# EasyEDA schematic SCH_keyboard_2024-02-28.json
TITLE: Sheet_1; REV: 1.0; Date: 2024-02-24; Sheet: 1/1; Drawn By: arnav.purbiya; Company: Your Company
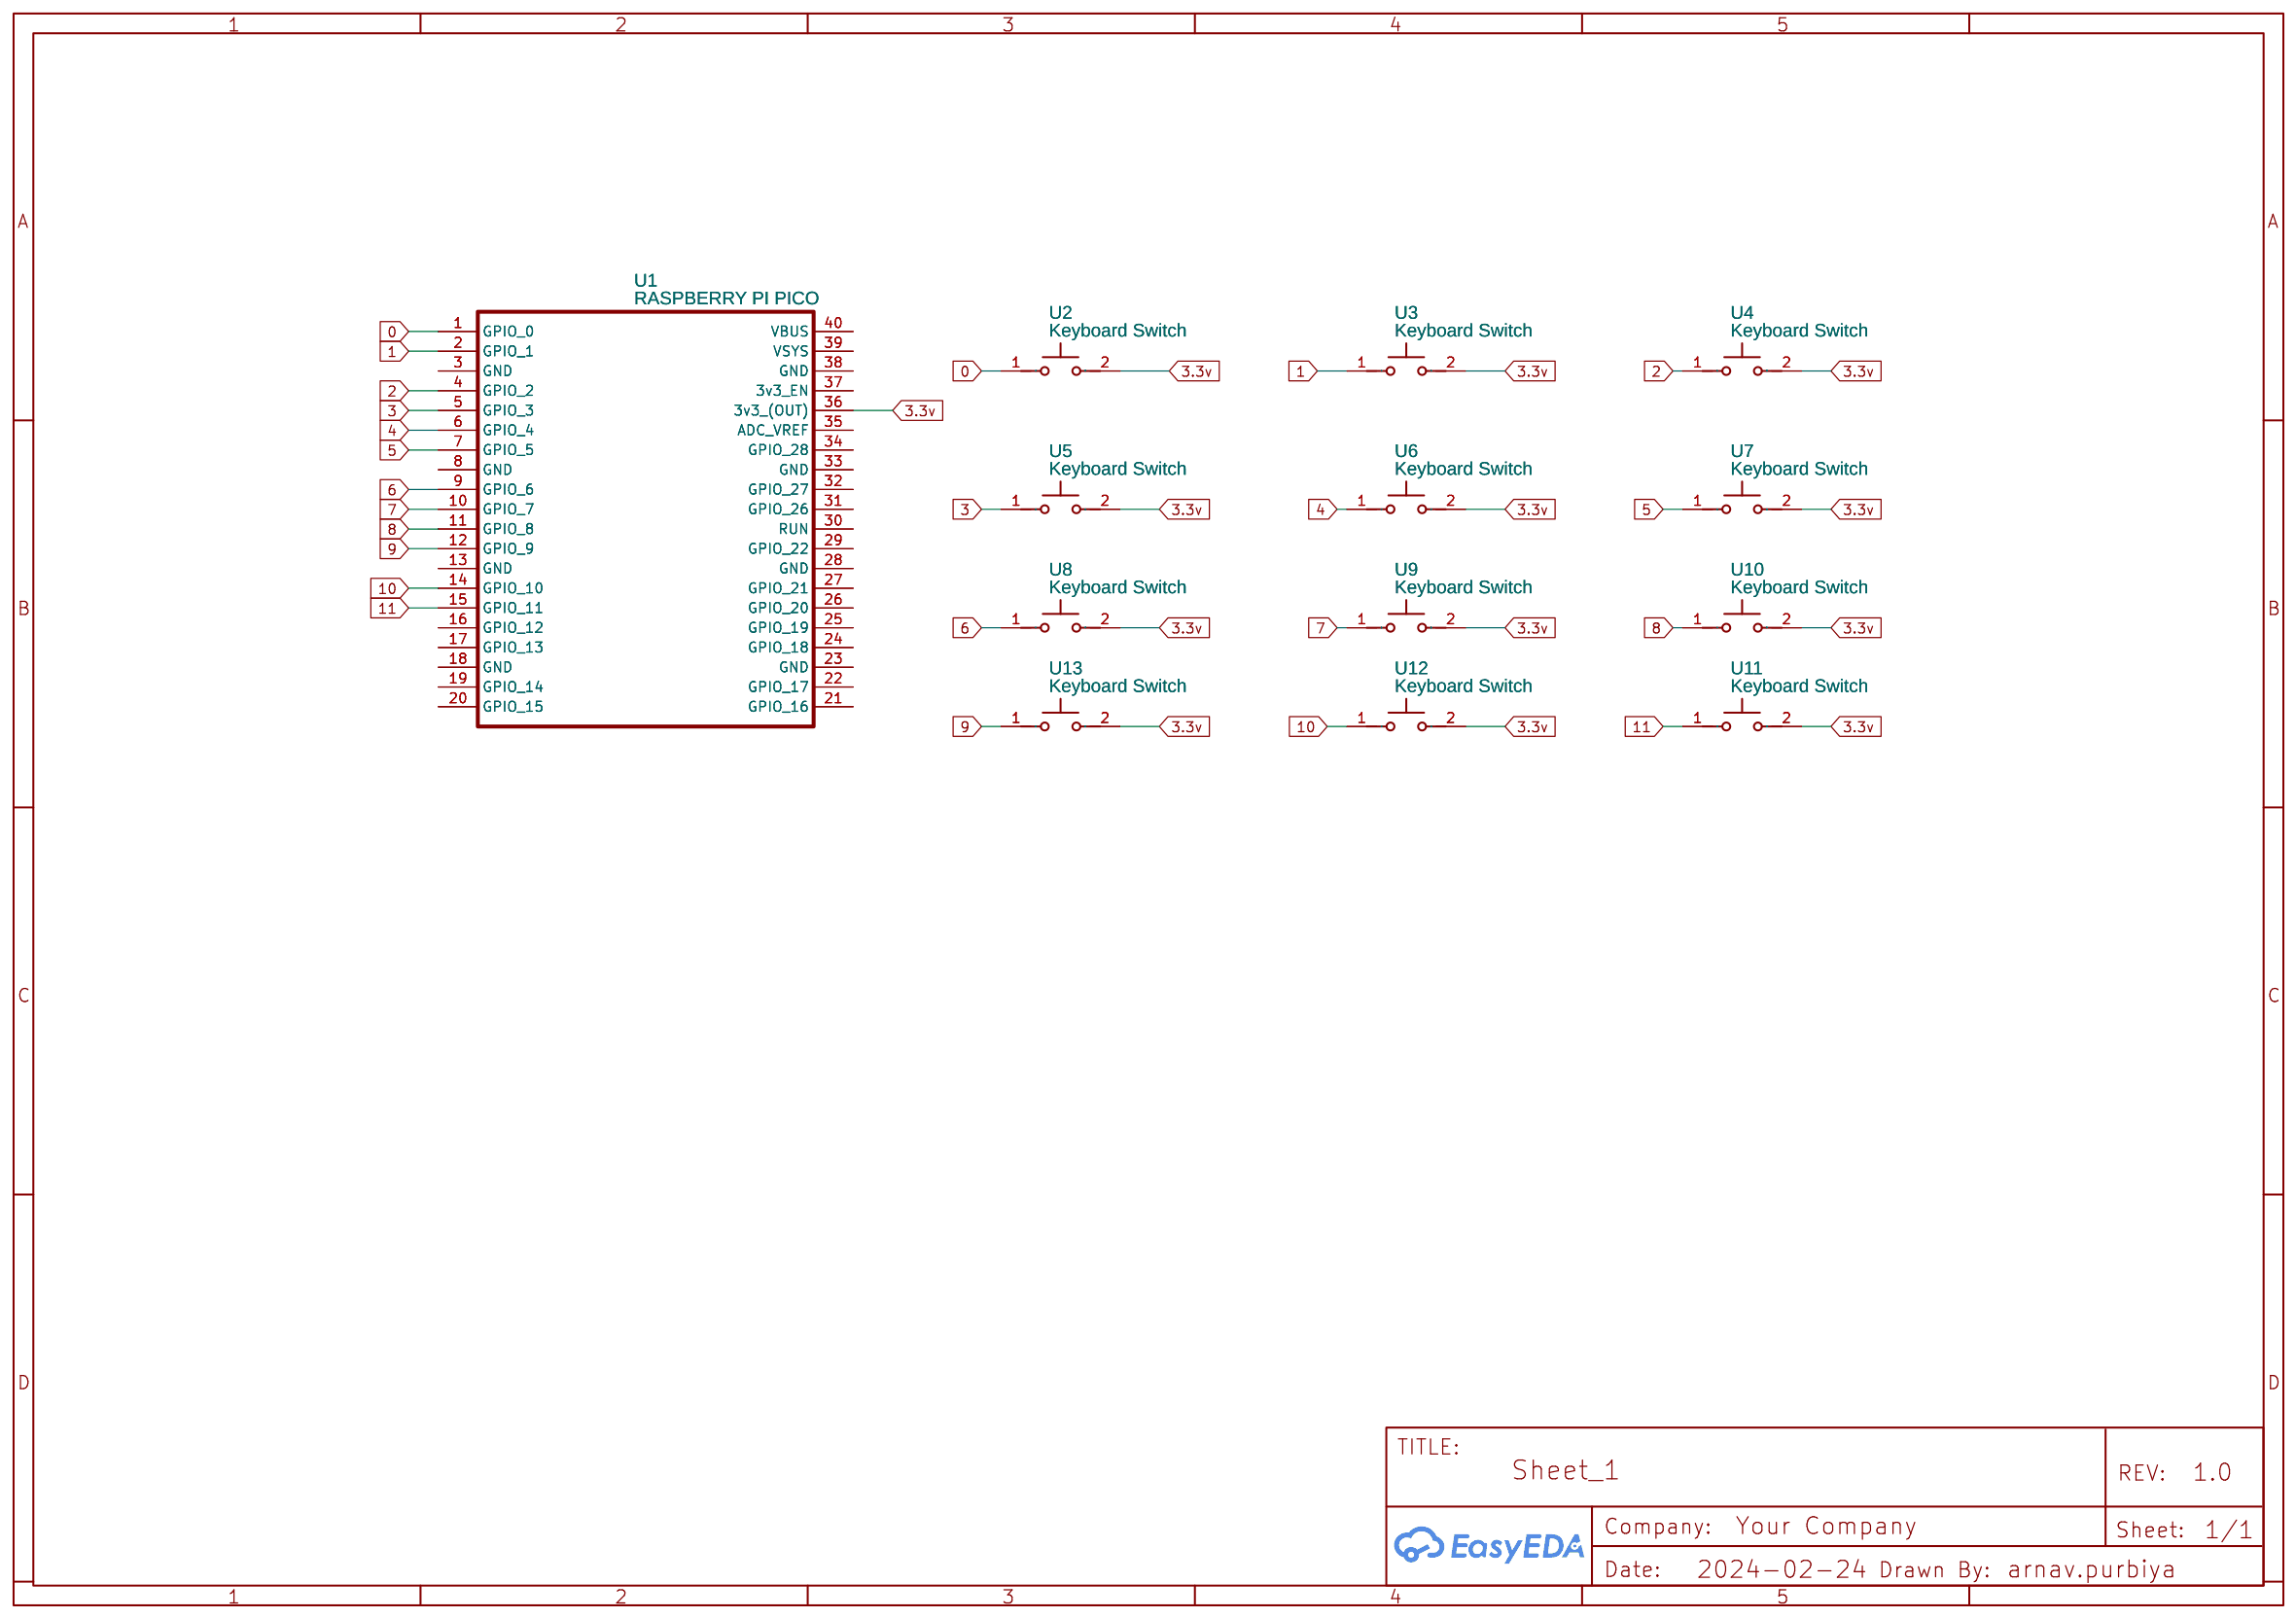
[diagram p0: schematic sheet]

## Parts
U1  RASPBERRY PI PICO  [RASPBERRY PI PICO/ RASPBERRY PI PICO W]
U2  Keyboard Switch  [KEYBOARD SIWTCH]
U3  Keyboard Switch  [KEYBOARD SIWTCH]
U4  Keyboard Switch  [KEYBOARD SIWTCH]
U5  Keyboard Switch  [KEYBOARD SIWTCH]
U6  Keyboard Switch  [KEYBOARD SIWTCH]
U7  Keyboard Switch  [KEYBOARD SIWTCH]
U8  Keyboard Switch  [KEYBOARD SIWTCH]
U9  Keyboard Switch  [KEYBOARD SIWTCH]
U10  Keyboard Switch  [KEYBOARD SIWTCH]
U11  Keyboard Switch  [KEYBOARD SIWTCH]
U12  Keyboard Switch  [KEYBOARD SIWTCH]
U13  Keyboard Switch  [KEYBOARD SIWTCH]

## Library data of the parts
U1 = RASPBERRY PI PICO: Contributor: Laurent Gorlier
U2-U13 = Keyboard Switch: Manufacturer: HepLer; Supplier: Others; Contributor: hepler

## Nets
3.3v: U1.36(3v3 (OUT)) U2.2 U3.2 U4.2 U5.2 U6.2 U7.2 U8.2 U9.2 U10.2 U11.2 U12.2 U13.2
0: U1.1(GPIO 0) U2.1
1: U1.2(GPIO 1) U3.1
2: U1.4(GPIO 2) U4.1
3: U1.5(GPIO 3) U5.1
4: U1.6(GPIO 4) U6.1
5: U1.7(GPIO 5) U7.1
6: U1.9(GPIO 6) U8.1
7: U1.10(GPIO 7) U9.1
8: U1.11(GPIO 8) U10.1
9: U1.12(GPIO 9) U13.1
10: U1.14(GPIO 10) U12.1
11: U1.15(GPIO 11) U11.1

Not connected (* = marked no-connect by the designer): U1 3(GND) 8(GND) 13(GND) 16(GPIO 12) 17(GPIO 13) 18(GND) 19(GPIO 14) 20(GPIO 15) 21(GPIO 16) 22(GPIO 17) 23(GND) 24(GPIO 18) 25(GPIO 19) 26(GPIO 20) 27(GPIO 21) 28(GND) 29(GPIO 22) 30(RUN) 31(GPIO 26) 32(GPIO 27) 33(GND) 34(GPIO 28) 35(ADC_VREF) 37(3v3_EN) 38(GND) 39(VSYS) 40(VBUS)
